# Altium schematic sheet GYBHDHT.SchDoc
size A4; DocumentNumber: 1; SheetNumber: 1; SheetTotal: 1
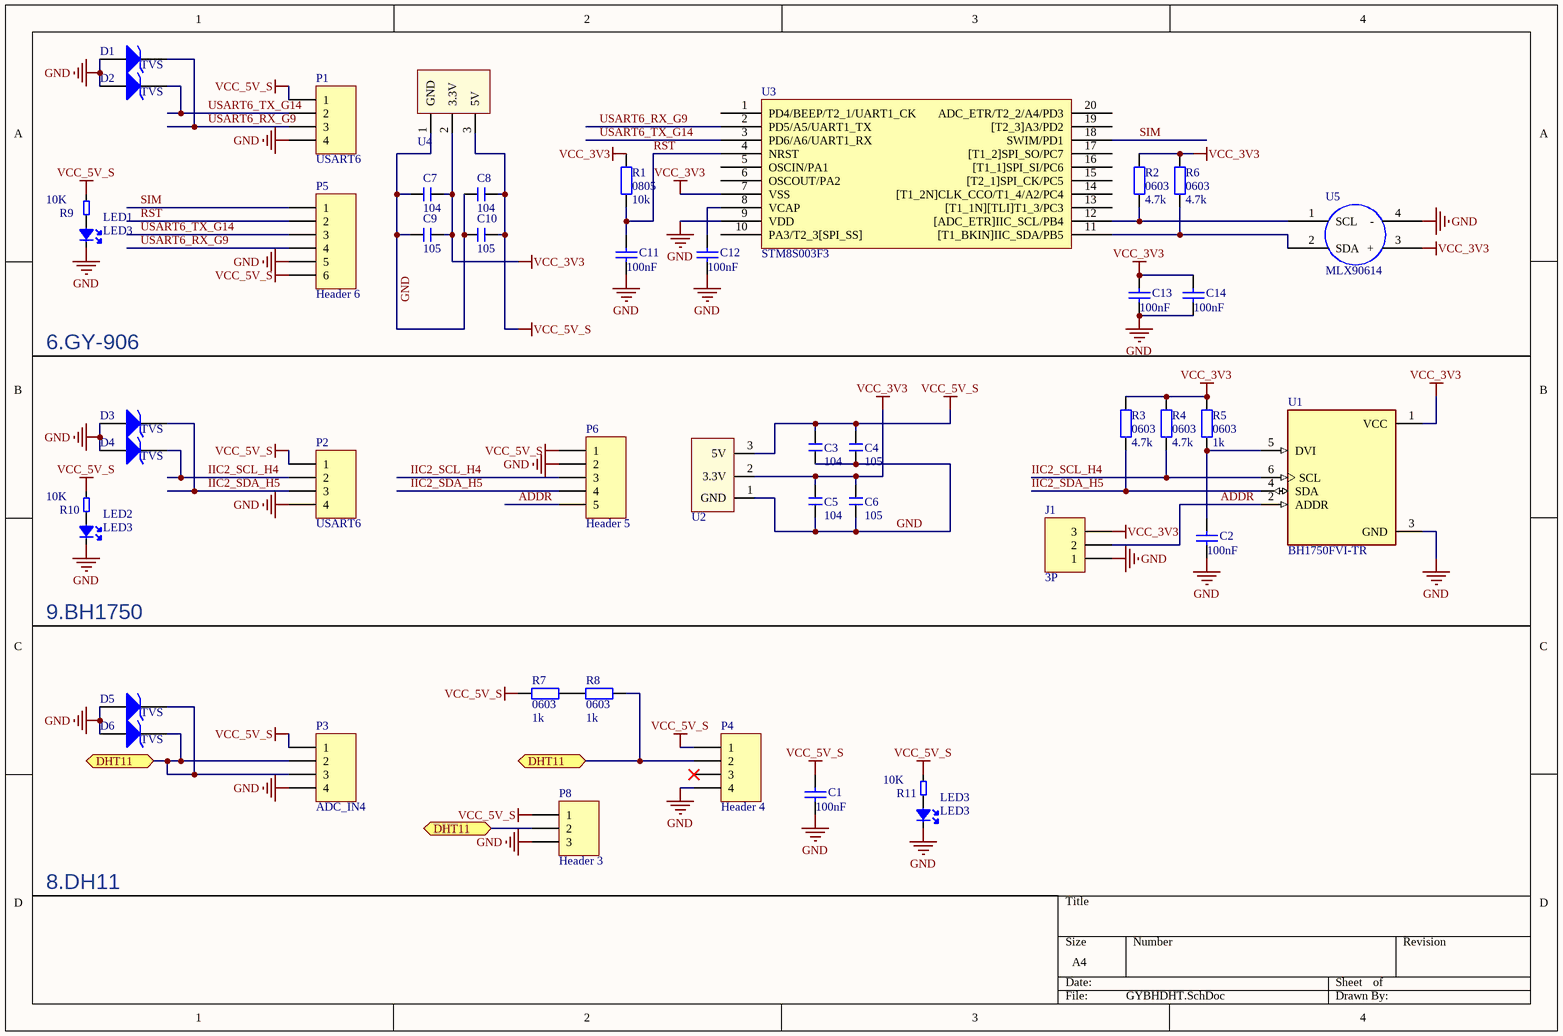
[diagram p0: GYBHDHT.SchDoc]

## Parts
C1  value 100nF  [C 0603_L]  (hidden comment: CAP)
C2  value 100nF  [C 0603_L]  (hidden comment: CAP)
C3  104  [C 0603]
C4  105  [C 0603]
C5  104  [C 0603]
C6  105  [C 0603]
C7  104  [C 0603]
C8  104  [C 0603]
C9  105  [C 0603]
C10  105  [C 0603]
C11  value 100nF  [C 0603_L]  (hidden comment: CAP)
C12  value 100nF  [C 0603_M]  (hidden comment: CAP)
C13  value 100nF  [C 0603_M]  (hidden comment: CAP)
C14  value 100nF  [C 0603_M]  (hidden comment: CAP)
D1  TVS  [SOD-523]
D2  TVS  [SOD-523]
D3  TVS  [SOD-523]
D4  TVS  [SOD-523]
D5  TVS  [SOD-523]
D6  TVS  [SOD-523]
J1  3P  [3P]
LED1  LED3  [0603-led]
LED2  LED3  [0603-led]
LED3  LED3  [0603-led]
P1  USART6  [KF2EDGK-2.54-WI-4P]
P2  USART6  [KF2EDGK-2.54-WI-4P]
P3  ADC_IN4  [KF2EDGK-2.54-WI-4P]
P4  Header 4  [HDR2.54-LI-4P]
P5  Header 6  [HDR2.54-LI-6P]
P6  Header 5  [HDR2.54-LI-5P]
P8  Header 3  [HDR2.54-LI-3P]
R1  0805  value 10k  [R 0603]
R2  0603  value 4.7k  [R 0603]
R3  0603  value 4.7k  [R 0603]
R4  0603  value 4.7k  [R 0603]
R5  0603  value 1k  [R 0603]
R6  0603  value 4.7k  [R 0603]
R7  0603  value 1k  [R 0603]
R8  0603  value 1k  [R 0603]
R9  10K  [0603]
R10  10K  [0603]
R11  10K  [0603]
U1  BH1750FVI-TR  [XDCR_BH1750FVI-TR]
U2  LM1117  [SOT23-3M]  (value not drawn)
U3  STM8S003F3  [TSSOP20]
U4  LM1117  [SOT23-3M]  (value not drawn)
U5  MLX90614  [MLX90614]

## Ports
DHT11 (bidir)

## Nets
GND: C1.1 C2.1 C3.1 C4.2 C5.1 C6.2 C7.1 C8.1 C9.2 C10.2 C11.1 C12.1 C13.1 C14.1 D1.1(A) D2.1(A) D3.1(A) D4.1(A) D5.1(A) D6.1(A) J1.1 LED1.2(K) LED2.2(K) LED3.2(K) P1.4 P2.4 P3.4 P4.4 P5.5 P6.2 P8.3 U1.3(GND) U2.1(GND) U3.9(VDD) U4.1(GND) U5.4(-)
VCC_3V3: C5.2 C6.1 C7.2 C9.1 C13.2 C14.2 J1.3 R1.1 R2.1 R3.1 R4.1 R5.1 R6.1 U1.1(VCC) U2.2(3.3V) U3.7(VSS) U4.2(3.3V) U5.3(+)
VCC_5V_S: C1.2 C3.2 C4.1 C8.2 C10.1 P1.1 P2.1 P3.1 P4.1 P5.6 P6.1 P8.1 R7.1 R9.2 R10.2 R11.2 U2.3(5V) U4.3(5V)
ADDR: J1.2 P6.5 U1.2(ADDR)
DHT11: D5.2(K) D6.2(K) P3.2 P3.3 P4.2 P8.2 R8.2 ; port DHT11
IIC2_SCL_H4: D4.2(K) P2.2 P6.3 R4.2 U1.6(SCL)
IIC2_SDA_H5: D3.2(K) P2.3 P6.4 R3.2 U1.4(SDA)
RST: C11.2 P5.2 R1.2 U3.4(NRST)
SIM: P5.1 U3.18(SWIM/PD1)
USART6_RX_G9: D1.2(K) P1.3 P5.4 U3.2(PD5/A5/UART1_TX)
USART6_TX_G14: D2.2(K) P1.2 P5.3 U3.3(PD6/A6/UART1_RX)
NetC2_2: C2.2 R5.2 U1.5(DVI)
NetC12_2: C12.2 U3.8(VCAP)
NetLED1_1: LED1.1(A) R9.1
NetLED2_1: LED2.1(A) R10.1
NetLED3_1: LED3.1(A) R11.1
NetR2_2: R2.2 U3.12([ADC_ETR]IIC_SCL/PB4) U5.1(SCL)
NetR6_2: R6.2 U3.11([T1_BKIN]IIC_SDA/PB5) U5.2(SDA)
NetR7_2: R7.2 R8.1

Not connected (* = marked no-connect by the designer): P4 3*; U3 1(PD4/BEEP/T2_1/UART1_CK) 5(OSCIN/PA1) 6(OSCOUT/PA2) 10(PA3/T2_3[SPI_SS]) 13([T1_1N][TLI]T1_3/PC3) 14([T1_2N]CLK_CCO/T1_4/A2/PC4) 15([T2_1]SPI_CK/PC5) 16([T1_1]SPI_SI/PC6) 17([T1_2]SPI_SO/PC7) 19([T2_3]A3/PD2) 20(ADC_ETR/T2_2/A4/PD3)

## Notes on the sheet
- 6.GY-906
- 9.BH1750
- 8.DH11

## Library data of the parts
C3-C10 = C: 无极性贴片电容; 版权归属: 源创客; BOM名称: 无极性贴片电容; 学习资源: www.ooocke.com
D1-D6 = D: High Conductance Fast Diode; Published: 8-Jun-2000; LatestRevisionDate: 17-Jul-2002; LatestRevisionNote: Re-released for DXP Platform.; DatasheetVersion: 1997; PackageReference: DO-35; Publisher: Altium Limited; PackageDescription: Diode, Axial; Body 3.8 x 1.9 mm (LxDia. max), Lead Dia. 0.53 mm (max); Code_JEDEC: DO-204-AH; ComponentLink1Description: Manufacturer Link; ComponentLink1URL: http://www.fairchildsemi.com/; ComponentLink2Description: Datasheet; ComponentLink2URL: http://www.fairchildsemi.com/ds/1N%2F1N4148.pdf
LED1-LED3 = CP_DIOLED: DIODE LED
P1-P4 = Header 4: Header, 4-Pin; LatestRevisionDate: 17-Jul-2002; LatestRevisionNote: Re-released for DXP Platform.; Publisher: Altium Limited
P5 = Header 6: Header, 6-Pin; LatestRevisionDate: 17-Jul-2002; LatestRevisionNote: Re-released for DXP Platform.; Publisher: Altium Limited
P6 = Header 5: Header, 5-Pin; LatestRevisionDate: 17-Jul-2002; LatestRevisionNote: Re-released for DXP Platform.; Publisher: Altium Limited
P8 = Header 3: Header, 3-Pin; LatestRevisionDate: 17-Jul-2002; LatestRevisionNote: Re-released for DXP Platform.; Publisher: Altium Limited
R1-R8 = RES2: Resistor; Published: 8-Jun-2000; LatestRevisionDate: 17-Jul-2002; LatestRevisionNote: Re-released for DXP Platform.; PackageReference: AXIAL-0.3; Publisher: Altium Limited; PackageDescription: Axial Device, Thru-Hole; 2 Leads; 0.3 in Pin Spacing
R9-R11 = RES2
U1 = BH1750FVI-TR: Optical Sensor Ambient 560nm IÂ²C 6-SMD, Flat Lead Exposed Pad; MF: Rohm; SnapEDA_Link: https://www.snapeda.com/parts/BH1750FVI-TR/Rohm/view-part/106507/?ref=snap; MP: BH1750FVI-TR; Price: None; Value: *; Availability: Unavailable; Package: SMD-6 Rohm
U3 = STM8S003F3: 8位STM单片机; 版权归属: 源创客; BOM名称: 8位STM单片机; 学习资源: www.ooocke.com